# Altium schematic sheet DRVPowerOutputs.SchDoc
size 292 x 193 mm; CheckedBy: Łukasz Gójski; Author: Jakub Howors; CompanyName: Politechnika Warszawska; Organization: EITI; Address1: Nowowiejska 15/19; Address2: 00-665 Warszawa; SheetNumber: 11; SheetTotal: 13; HTTPLink: www.pw.edu.pl
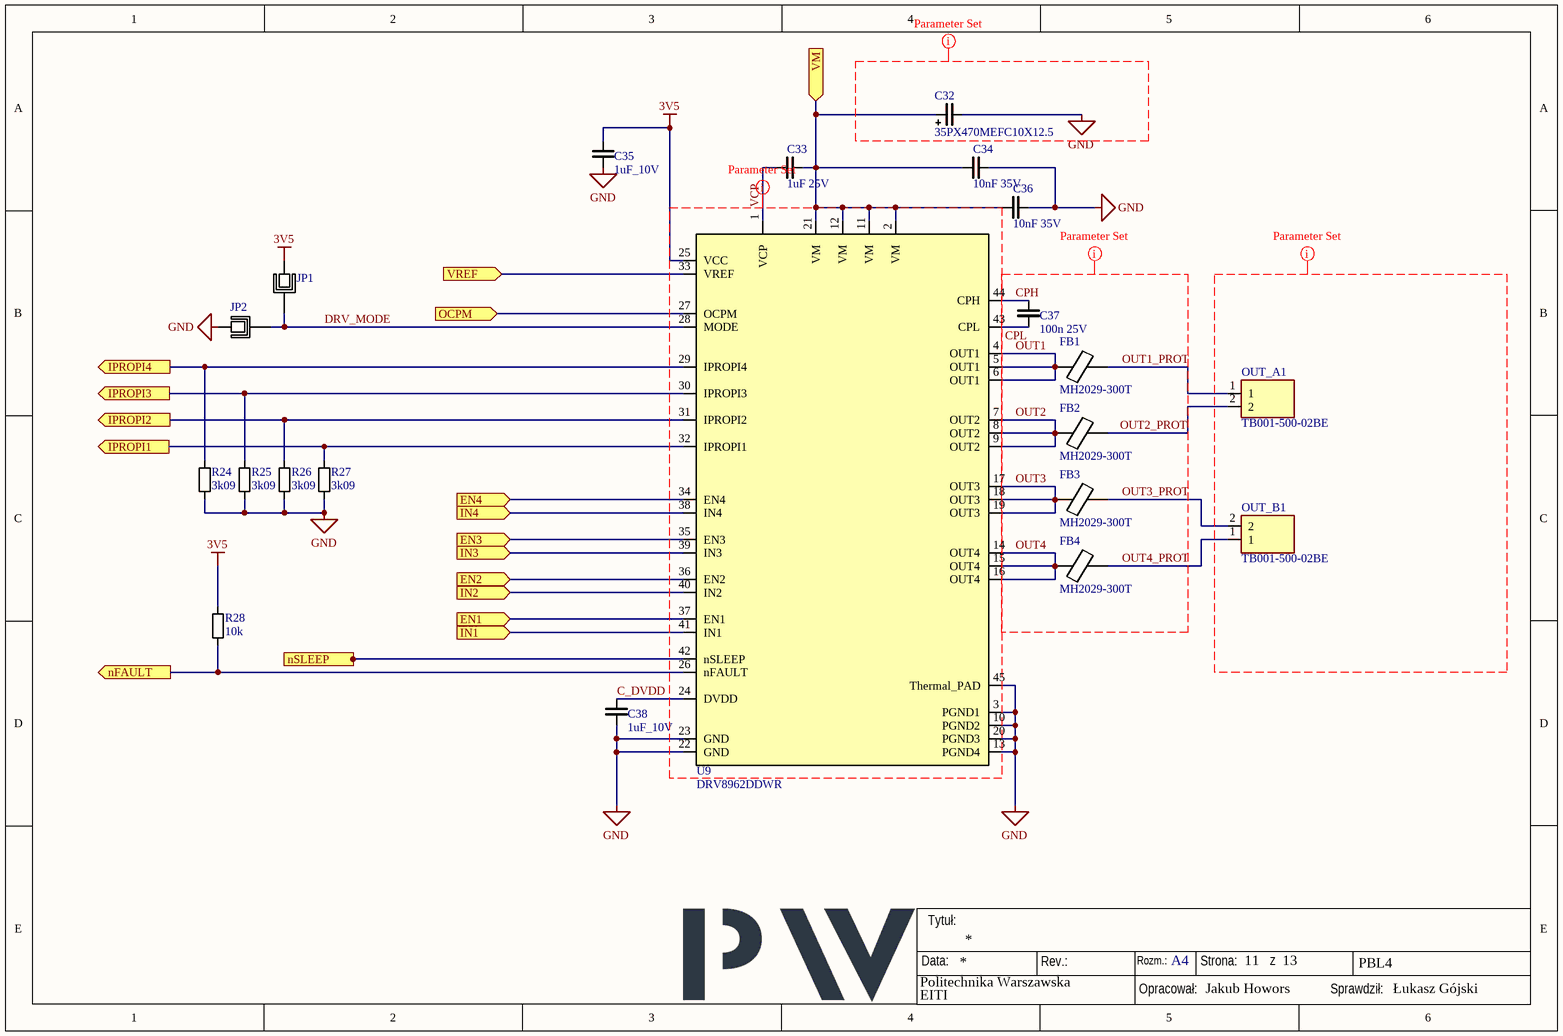
[diagram p0: DRVPowerOutputs.SchDoc]

## Parts
C32  35PX470MEFC10X12.5  [CAP_PKPZ_10X12P5_LOW_RUB]
C33  1uF 25V  [C_0603]
C34  10nF 35V  [0603_CAP]
C35  1uF_10V  [C_0603]
C36  10nF 35V  [0603_CAP]
C37  100n 25V  [C_0603]
C38  1uF_10V  [C_0603]
FB1  MH2029-300T  [MH2029-300T]
FB2  MH2029-300T  [MH2029-300T]
FB3  MH2029-300T  [MH2029-300T]
FB4  MH2029-300T  [MH2029-300T]
JP1  JUMPER  [Jumper]  (value not drawn)
JP2  JUMPER  [Jumper]  (value not drawn)
OUT_A1  TB001-500-02BE  [TB00150002BE]
OUT_B1  TB001-500-02BE  [TB00150002BE]
R24  3k09  [R_0603]
R25  3k09  [R_0603]
R26  3k09  [R_0603]
R27  3k09  [R_0603]
R28  10k  [R_0603]
U9  DRV8962DDWR  [DDW0044E-MFG]

## Ports
EN1 (in, see PowerOutputsAssembly[5B]), EN2 (in, see PowerOutputsAssembly[5B]), EN3 (in, see PowerOutputsAssembly[5A]), EN4 (in, see PowerOutputsAssembly[5A]), IN1 (in, see PowerOutputsAssembly[5B]), IN2 (in, see PowerOutputsAssembly[5B]), IN3 (in, see PowerOutputsAssembly[5B]), IN4 (in, see PowerOutputsAssembly[5A]), IPROPI1 (out, see PowerOutputsAssembly[6A]), IPROPI2 (out, see PowerOutputsAssembly[6A]), IPROPI3 (out, see PowerOutputsAssembly[6A]), IPROPI4 (out, see PowerOutputsAssembly[6A]), nFAULT (out, see PowerOutputsAssembly[6A]), nSLEEP (in, see PowerOutputsAssembly[5B]), OCPM (in, see PowerOutputsAssembly[5A]), VM (in, see PowerOutputsAssembly[5B]), VREF (in, see PowerOutputsAssembly[5A])

## Nets
3V5: C35.2 JP1.1 R28.1 U9.25(VCC)
GND: C32.2 C34.2 C35.1 C36.2 C38.1 JP2.1 R24.1 R25.1 R26.1 R27.1 U9.3(PGND1) U9.10(PGND2) U9.13(PGND4) U9.20(PGND3) U9.22(GND) U9.23(GND) U9.45(Thermal_PAD)
C_DVDD: C38.2 U9.24(DVDD)
CPH: C37.2 U9.44(CPH)
CPL: C37.1 U9.43(CPL)
DRV_MODE: JP1.2 JP2.2 U9.28(MODE)
EN1: U9.37(EN1) ; port EN1
EN2: U9.36(EN2) ; port EN2
EN3: U9.35(EN3) ; port EN3
EN4: U9.34(EN4) ; port EN4
IN1: U9.41(IN1) ; port IN1
IN2: U9.40(IN2) ; port IN2
IN3: U9.39(IN3) ; port IN3
IN4: U9.38(IN4) ; port IN4
IPROPI1: R27.2 U9.32(IPROPI1) ; port IPROPI1
IPROPI2: R26.2 U9.31(IPROPI2) ; port IPROPI2
IPROPI3: R25.2 U9.30(IPROPI3) ; port IPROPI3
IPROPI4: R24.2 U9.29(IPROPI4) ; port IPROPI4
nFAULT: R28.2 U9.26(nFAULT) ; port nFAULT
nSLEEP: U9.42(nSLEEP) ; port nSLEEP
OCPM: U9.27(OCPM) ; port OCPM
OUT1: FB1.1 U9.4(OUT1) U9.5(OUT1) U9.6(OUT1)
OUT1_PROT: FB1.2 OUT_A1.1
OUT2: FB2.1 U9.7(OUT2) U9.8(OUT2) U9.9(OUT2)
OUT2_PROT: FB2.2 OUT_A1.2
OUT3: FB3.1 U9.17(OUT3) U9.18(OUT3) U9.19(OUT3)
OUT3_PROT: FB3.2 OUT_B1.2
OUT4: FB4.1 U9.14(OUT4) U9.15(OUT4) U9.16(OUT4)
OUT4_PROT: FB4.2 OUT_B1.1
VCP: C33.1 U9.1(VCP)
VM: C32.1 C33.2 C34.1 C36.1 U9.2(VM) U9.11(VM) U9.12(VM) U9.21(VM) ; port VM
VREF: U9.33(VREF) ; port VREF

## Layout directives
CompClassName: NoRelief: CPH, CPL, OUT1, OUT1_PROT, OUT2, OUT2_PROT, OUT3, OUT3_PROT, OUT4, OUT4_PROT, VCP
CompClassName: ThickRelief: (no net found under the mark), GND

## Notes on the sheet
- Data:
- Tytuł:
- Rev.:
- Rozm.:
- A4
- Strona:
- z
- PBL4
- Opracował:
- Sprawdził:

## Library data of the parts
C32 = C_Pol_470uF_35V: 470 µF 35 V Aluminum Electrolytic Capacitors Radial, Can 2000 Hrs @ 105°C; Manufacturer: Rubycon; Value: 470u; Voltage: 35V; Tolerance: 20%
C33 = C_1uF_25V: Ceramic capacitor; Value: 1u; Casing: 0603; Dielectric: XR7; Tolerance: 10%; Voltage: 25V; Technology: Ceramic
C34 C36 = Cap_10nF: Ceramic capacitor; Casing: 0603; Tolerance: 5%; Dielectric: X7R; Value: 10nF; Voltage: 35V
C35 C38 = C_1uF_10V: Ceramic capacitor; Value: 1u; Voltage: 10V; Casing: 0603; Dielectric: X7R; Tolerance: 10%; Technology: Ceramic
C37 = C_100nF_25V: Ceramic capacitor; Casing: 0603; Dielectric: X7R; Tolerance: 10%; Value: 100n; Voltage: 25V; Technology: Ceramic
FB1-FB4 = FerriteBead_8A5: Ferrite bead; Manufacturer: Bourns Inc.
JP1 JP2 = Jumper x2: Jumper on traces
OUT_A1 OUT_B1 = Screw Terminal x2 5mm: Screw terminal x2 5mm spacing; Manufacturer: Same Sky; MP: TB001-500-02BE
R24-R27 = R_3k09: Resistor; Tolerance: 1%; Power: 100mW; Casing: 0603; Value: 3k09
R28 = R_10k: Resistor; Tolerance: 1%; Power: 100mW; Casing: 0603; Value: 10k
U9 = IC_drv8962_PDRV8962DDWR: 65-V four-channel half-bridge driver with current sense outputs 44-HTSSOP; Manufacturer: Texas Instruments; Manufacturer_Part_Number: DRV8962DDWR